# EAGLE design Lucette_V05 (EAGLE 6.1)
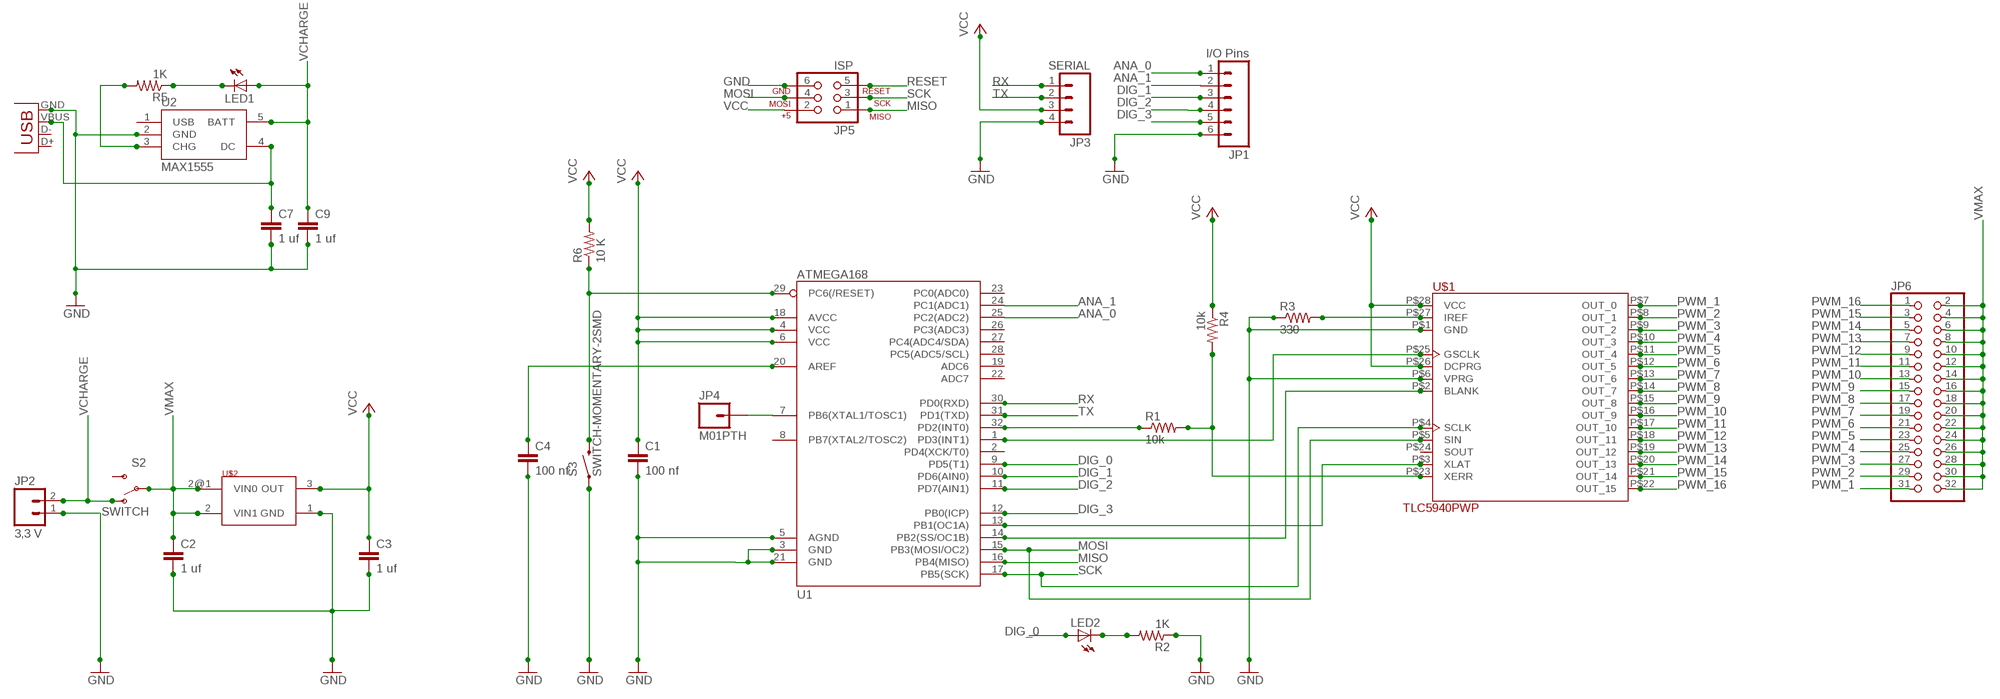
[diagram p0: schematic, sheet 1]

## Parts
C1  100 nf  CAP0805  [0805]
C2  1 uf  CAP0805  [0805]
C3  1 uf  CAP0805  [0805]
C4  100 nf  CAP0805  [0805]
C7  1 uf  CAP0805  [0805]
C9  1 uf  CAP0805  [0805]
JP1  I/O Pins  M06SMD  [1X06-SMD]
JP2  3,3 V  M02-JST-2MM-SMT  [S2B-PH]
JP3  SERIAL  M04SMD  [1X04-SMD]
JP4  M01PTH  [1X01]
JP5  ISP  AVR_SPI_PRG_6PTH  [2X3]
JP6  PINHD-2X16/90  [2X16/90]
LED1  LEDCHIP-LED0805  [CHIP-LED0805]
LED2  LEDCHIP-LED0805  [CHIP-LED0805]
R1  10k  RESISTOR1206  [1206]
R2  1K  RESISTOR1206  [1206]
R3  330  RESISTOR1206  [1206]
R4  10k  RESISTOR1206  [1206]
R5  1K  RESISTOR1206  [1206]
R6  10 K  RESISTOR1206  [1206]
S2  SWITCH  SWITCH-SPSTSMD  [AYZ0202]
S3  SWITCH-MOMENTARY-2SMD  [TACTILE_SWITCH_SMD]
U1  ATMEGA168  [TQFP32-08]
U2  MAX1555  [SOT23-5]
U$1  TLC5940PWP  [PWP-28]
U$2  MCP1703  [SOT98]
X1  USBOLD  [USB-MINIB-OLD]

## Nets
ANA_0: JP1.1 U1.25(PC2(ADC2))
ANA_1: JP1.2 U1.24(PC1(ADC1))
DIG_0: LED2.A U1.9(PD5(T1))
DIG_1: JP1.3 U1.10(PD6(AIN0))
DIG_2: JP1.4 U1.11(PD7(AIN1))
DIG_3: JP1.5 U1.12(PB0(ICP))
GND [gnd_plane]: C1.2 C2.2 C3.2 C4.2 C7.2 C9.2 JP1.6 JP2.1 JP3.4 JP5.6 R2.1 R3.1 S3.1 U1.3(GND) U1.5(AGND) U1.21(GND) U2.2(GND) U$1.P$1(GND) U$1.P$6(VPRG) U$2.1(GND) X1.GND
MISO: JP5.1 U1.16(PB4(MISO))
MOSI: JP5.4 U1.15(PB3(MOSI/OC2)) U$1.P$5(SIN)
N$1: R1.2 R4.2 U$1.P$23(XERR)
N$2: R1.1 U1.32(PD2(INT0))
N$3: C7.1 U2.4(DC) X1.VBUS
N$5: R5.2 U2.3(CHG)
N$6: U1.13(PB1(OC1A)) U$1.P$3(XLAT)
N$7: LED1.C R5.1
N$8: C4.1 U1.20(AREF)
N$9: R3.2 U$1.P$27(IREF)
N$10: JP4.1 U1.7(PB6(XTAL1/TOSC1))
N$11: LED2.C R2.2
N$31: U1.1(PD3(INT1)) U$1.P$25(GSCLK)
N$47: U1.14(PB2(SS/OC1B)) U$1.P$2(BLANK)
PWM_1: JP6.31 U$1.P$7(OUT_0)
PWM_2: JP6.29 U$1.P$8(OUT_1)
PWM_3: JP6.27 U$1.P$9(OUT_2)
PWM_4: JP6.25 U$1.P$10(OUT_3)
PWM_5: JP6.23 U$1.P$11(OUT_4)
PWM_6: JP6.21 U$1.P$12(OUT_5)
PWM_7: JP6.19 U$1.P$13(OUT_6)
PWM_8: JP6.17 U$1.P$14(OUT_7)
PWM_9: JP6.15 U$1.P$15(OUT_8)
PWM_10: JP6.13 U$1.P$16(OUT_9)
PWM_11: JP6.11 U$1.P$17(OUT_10)
PWM_12: JP6.9 U$1.P$18(OUT_11)
PWM_13: JP6.7 U$1.P$19(OUT_12)
PWM_14: JP6.5 U$1.P$20(OUT_13)
PWM_15: JP6.3 U$1.P$21(OUT_14)
PWM_16: JP6.1 U$1.P$22(OUT_15)
RESET: JP5.5 R6.1 S3.3 U1.29(PC6(/RESET))
RX: JP3.1 U1.30(PD0(RXD))
SCK: JP5.3 U1.17(PB5(SCK)) U$1.P$4(SCLK)
TX: JP3.2 U1.31(PD1(TXD))
VCC: C1.1 C3.1 JP3.3 JP5.2 R4.1 R6.2 U1.4(VCC) U1.6(VCC) U1.18(AVCC) U$1.P$26(DCPRG) U$1.P$28(VCC) U$2.3(OUT)
VCHARGE [VDD]: C9.1 JP2.2 LED1.A S2.1(O) U2.5(BATT)
VMAX [VDD]: C2.1 JP6.2 JP6.4 JP6.6 JP6.8 JP6.10 JP6.12 JP6.14 JP6.16 JP6.18 JP6.20 JP6.22 JP6.24 JP6.26 JP6.28 JP6.30 JP6.32 S2.2(P) U$2.2(VIN1) U$2.2@1(VIN0)
Unconnected: S2.3(S) U1.2(PD4(XCK/T0)) U1.8(PB7(XTAL2/TOSC2)) U1.19(ADC6) U1.22(ADC7) U1.23(PC0(ADC0)) U1.26(PC3(ADC3)) U1.27(PC4(ADC4/SDA)) U1.28(PC5(ADC5/SCL)) U2.1(USB) U$1.P$24(SOUT) X1.D+ X1.D-

## Library data of the parts
C1-C4 C7 C9 = spark-fun:CAP: Capacitor Standard 0603 ceramic capacitor, and 0.1" leaded capacitor.
JP1 = spark-fun:M06: Header 6 Standard 6-pin 0.1" header. Use with straight break away headers (SKU : PRT-00116), right angle break away headers (PRT-00553), swiss pins (PRT-00743), machine pins (PRT-00117), and female headers (PRT-00115). Molex polarized connector foot print use with SKU : PRT-08094 with associated crimp pins and housings. NOTES ON THE VARIANTS LOCK and LOCK_LONGPADS... This footprint was designed to help hold the alignment of a through-hole component (i.e. 6-pin header) while soldering it into place. You may notice that each hole has been shifted either up or down by 0.005 of an inch from it's more standard position (which is a perfectly straight line). This slight alteration caused the pins (the squares in the middle) to touch the edges of the holes. Because they are alternating, it causes a "brace" to hold the component in place. 0.005 has proven to be the perfect amount of "off-center" position when using our standard breakaway headers. Although looks a little odd when you look at the bare footprint, once you have a header in there, the alteration is very hard to notice. Also, if you push a header all the way into place, it is covered up entirely on the bottom side. This idea of altering the position of holes to aid alignment will be further integrated into the Sparkfun Library for other footprints. It can help hold any component with 3 or more connection pins.
JP2 = spark-fun:M02: Header 2 Standard 2-pin 0.1" header. Use with straight break away headers (SKU : PRT-00116), right angle break away headers (PRT-00553), swiss pins (PRT-00743), machine pins (PRT-00117), and female headers (PRT-00115). Molex polarized connector foot print use with SKU : PRT-08233 with associated crimp pins and housings.
JP3 = spark-fun:M04: Header 4 Standard 4-pin 0.1" header. Use with straight break away headers (SKU : PRT-00116), right angle break away headers (PRT-00553), swiss pins (PRT-00743), machine pins (PRT-00117), and female headers (PRT-00115). Molex polarized connector foot print use with SKU : PRT-08231 with associated crimp pins and housings.
JP4 = SparkFun:M01: Header 1 Standard 1-pin 0.1" header. Use with straight break away headers (SKU : PRT-00116), right angle break away headers (PRT-00553), swiss pins (PRT-00743), machine pins (PRT-00117), and female headers (PRT-00115).
JP5 = SparkFun:AVR_SPI_PRG_6: AVR ISP 6 Pin This is the reduced ISP connector for AVR programming. Common on Arduino. This footprint will take up less PCB space and can be used with a 10-pin to 6-pin adapter such as SKU: BOB-08508
JP6 = pinhead:PINHD-2X16: PIN HEADER
LED1 LED2 = led:LED: LED OSRAM: - CHIPLED LG R971, LG N971, LY N971, LG Q971, LY Q971, LO R971, LY R971 LH N974, LH R974 LS Q976, LO Q976, LY Q976 LO Q996 - Hyper CHIPLED LW Q18S LB Q993, LB Q99A, LB R99A - SideLED LS A670, LO A670, LY A670, LG A670, LP A670 LB A673, LV A673, LT A673, LW A673 LH A674 LY A675 LS A676, LA A676, LO A676, LY A676, LW A676 LS A679, LY A679, LG A679 - Hyper Micro SIDELED® LS Y876, LA Y876, LO Y876, LY Y876 LT Y87S - SmartLED LW L88C, LW L88S LB L89C, LB L89S, LG L890 LS L89K, LO L89K, LY L89K LS L896, LA L896, LO L896, LY L896 - TOPLED LS T670, LO T670, LY T670, LG T670, LP T670 LSG T670, LSP T670, LSY T670, LOP T670, LYG T670 LG T671, LOG T671, LSG T671 LB T673, LV T673, LT T673, LW T673 LH T674 LS T676, LA T676, LO T676, LY T676, LB T676, LH T676, LSB T676, LW T676 LB T67C, LV T67C, LT T67C, LS T67K, LO T67K, LY T67K, LW E67C LS E67B, LA E67B, LO E67B, LY E67B, LB E67C, LV E67C, LT E67C LW T67C LS T679, LY T679, LG T679 LS T770, LO T770, LY T770, LG T770, LP T770 LB T773, LV T773, LT T773, LW T773 LH T774 LS E675, LA E675, LY E675, LS T675 LS T776, LA T776, LO T776, LY T776, LB T776 LHGB T686 LT T68C, LB T68C - Hyper Mini TOPLED® LB M676 - Mini TOPLED Santana® LG M470 LS M47K, LO M47K, LY M47K Source: http://www.osram.convergy.de LUXEON: - LUMILED® LXK2-PW12-R00, LXK2-PW12-S00, LXK2-PW14-U00, LXK2-PW14-V00 LXK2-PM12-R00, LXK2-PM12-S00, LXK2-PM14-U00 LXK2-PE12-Q00, LXK2-PE12-R00, LXK2-PE12-S00, LXK2-PE14-T00, LXK2-PE14-U00 LXK2-PB12-K00, LXK2-PB12-L00, LXK2-PB12-M00, LXK2-PB14-N00, LXK2-PB14-P00, LXK2-PB14-Q00 LXK2-PR12-L00, LXK2-PR12-M00, LXK2-PR14-Q00, LXK2-PR14-R00 LXK2-PD12-Q00, LXK2-PD12-R00, LXK2-PD12-S00 LXK2-PH12-R00, LXK2-PH12-S00 LXK2-PL12-P00, LXK2-PL12-Q00, LXK2-PL12-R00 Source: www.luxeon.com KINGBRIGHT: KA-3528ASYC Source: www.kingbright.com
R1-R6 = spark-fun:RESISTOR: Resistor Basic schematic elements and footprints for 0603, 1206, and PTH 1/10th watt (small) resistors.
S2 = spark-fun:SWITCH-SPST: SPST Switch Simple slide switch. Spark Fun Electronics SKU : COM-00102
S3 = spark-fun:SWITCH-MOMENTARY-2
U1 = spark-fun:ATMEGA168
U2 = spark-fun:MAX1555: MAX1555 Lithium Charger IC SOT-23 Lithium Polymer charging IC. Schematic element and footprint proven. Spark Fun Electronics SKU : COM-00674
U$1 = tlc5940:TLC5940
U$2 = MCP1703:MCP1703
X1 = spark-fun:USB: USB Connectors USB-B-PTH is fully proven SKU : PRT-00139 USB-miniB is fully proven SKU : PRT-00587 USB-A-PCB is untested. USB-A-H is throughly reviewed, but untested. Spark Fun Electronics SKU : PRT-00437 USB-B-SMT is throughly reviewed, but untested. Needs silkscreen touching up. USB-A-S has not been used/tested USB-MB-H has not been used/tested

## Net classes
0 default: width 0.24 mm, drill 0.8 mm, clearance 0.432 mm
2 gnd_plane: width 2 mm, drill 0.8 mm, clearance 0.025 mm
3 vcc: width 1 mm, drill 0.8 mm, clearance 0.381 mm
4 VDD: width 1 mm, clearance 0.381 mm

## Board
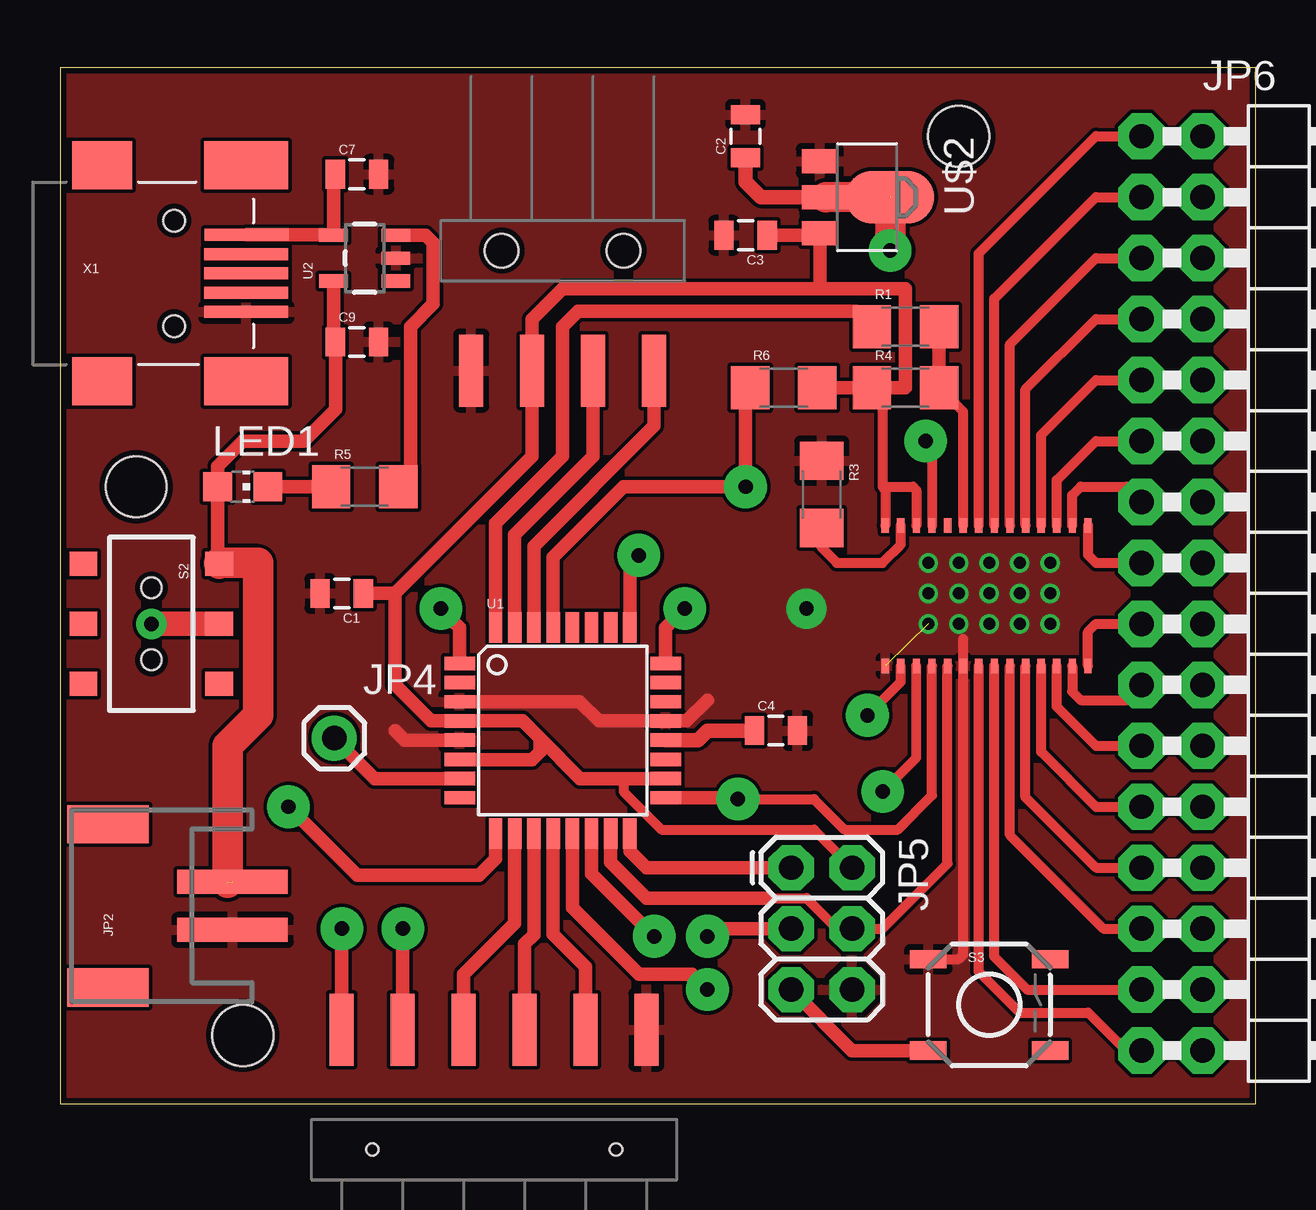
[diagram p1: board, top side]
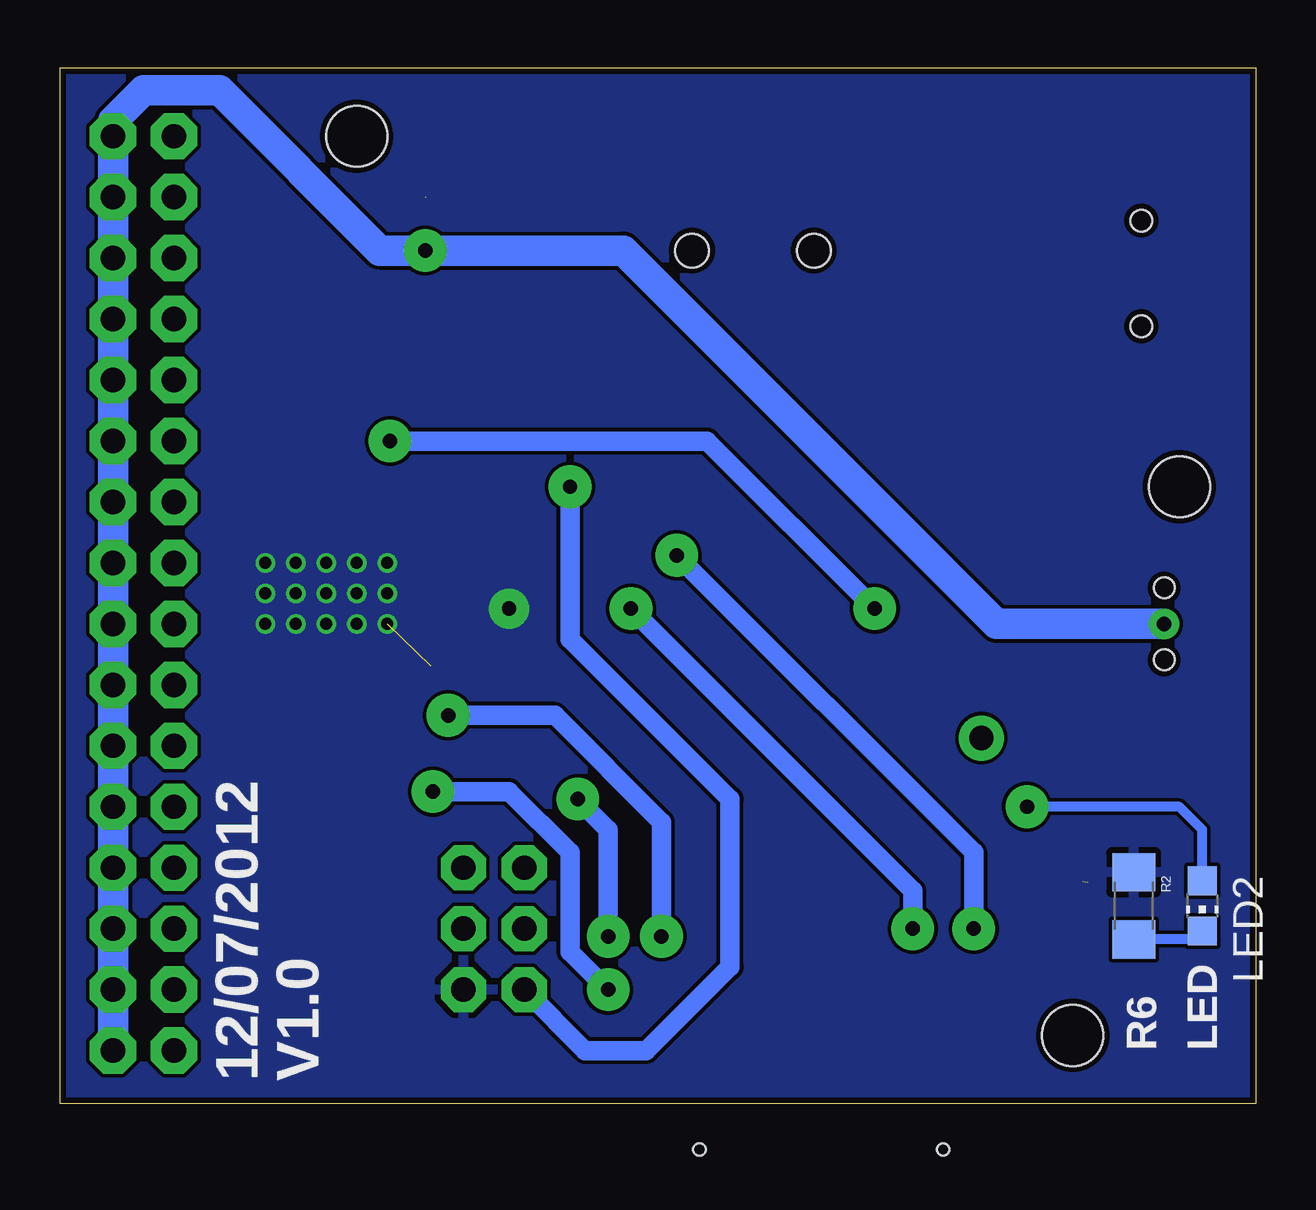
[diagram p2: board, bottom side, seen from below]

Size 49.84 x 43.17 mm. Coordinates in mm from the lower left corner, seen from the top.
Outline: 0,0 49.84,0 49.84,43.17 0,43.17 0,0
Copper layers (1*16): Top 0.035mm / dielectric 1.5mm / Bottom 0.035mm
Design rules "default": minimum track width 6mil, minimum drill 12mil, track to track 6mil, track to pad 6mil, pad to pad 6mil, via to via 6mil, smd to smd 0mil, copper to edge 10mil, drill to drill 10mil, minimum pad ring 10mil, minimum via ring 6mil, stop-mask expansion 2mil, vias tented up to drill 100mil, thermal gap 10mil
Holes 2.54 mm at 3.17,25.72 7.62,2.86 37.47,40.32

### Footprints (pad centres in the part's own frame; a part is rotated, then mirrored left to right if it is on the bottom)
0805 = smd 0.8 x 1.2: 1 -0.9,0; 2 0.9,0
1X06-SMD = smd 1 x 3: 1 -6.35,5; 2 -3.81,5; 3 -1.27,5; 4 1.27,5; 5 3.81,5; 6 6.35,5 | hole 0.508: -5.08,0; 5.08,0
S2B-PH = smd 1 x 4.6: 1 -1,-3.7; 2 1,-3.7 | smd 1.6 x 3.4: NC1 -3.4,1.5; NC2 3.4,1.5
1X04-SMD = smd 1 x 3: 1 -3.81,5; 2 -1.27,5; 3 1.27,5; 4 3.81,5 | hole 1.4: -2.54,0; 2.54,0
1X01 = drill 1.016 pad 1.88: 1 0,0
2X3 = drill 1.016 pad 1.88 octagon: 1 0,0; 2 0,2.54; 3 2.54,0; 4 2.54,2.54; 5 5.08,0; 6 5.08,2.54
2X16/90 = drill 1.016 pad 1.93 octagon: 1 -19.05,-6.35; 2 -19.05,-3.81; 3 -16.51,-6.35; 4 -16.51,-3.81; 5 -13.97,-6.35; 6 -13.97,-3.81; 7 -11.43,-6.35; 8 -11.43,-3.81; 9 -8.89,-6.35; 10 -8.89,-3.81; 11 -6.35,-6.35; 12 -6.35,-3.81; 13 -3.81,-6.35; 14 -3.81,-3.81; 15 -1.27,-6.35; 16 -1.27,-3.81; 17 1.27,-6.35; 18 1.27,-3.81; 19 3.81,-6.35; 20 3.81,-3.81; 21 6.35,-6.35; 22 6.35,-3.81; 23 8.89,-6.35; 24 8.89,-3.81; 25 11.43,-6.35; 26 11.43,-3.81; 27 13.97,-6.35; 28 13.97,-3.81; 29 16.51,-6.35; 30 16.51,-3.81; 31 19.05,-6.35; 32 19.05,-3.81
CHIP-LED0805 = smd 1.2 x 1.2: A 0,-1.05; C 0,1.05
1206 = smd 1.6 x 1.8: 1 -1.4,0; 2 1.4,0
AYZ0202 = smd 1 x 1.15: 1 -2.5,2.825; 2 0,2.825; 3 2.5,2.825; 4 -2.5,-2.825; 5 0,-2.825; 6 2.5,-2.825 | hole 0.85: 1.5,0; -1.5,0
TACTILE_SWITCH_SMD = smd 1.524 x 0.762: 1 -2.54,1.905; 2 2.54,1.905; 3 -2.54,-1.905; 4 2.54,-1.905
TQFP32-08 = smd 1.27 x 0.559: 1 -4.293,2.8; 2 -4.293,2; 3 -4.293,1.2; 4 -4.293,0.4; 5 -4.293,-0.4; 6 -4.293,-1.2; 7 -4.293,-2; 8 -4.293,-2.8; 17 4.293,-2.8; 18 4.293,-2; 19 4.293,-1.2; 20 4.293,-0.4; 21 4.293,0.4; 22 4.293,1.2; 23 4.293,2; 24 4.293,2.8 | smd 0.559 x 1.27: 9 -2.8,-4.293; 10 -2,-4.293; 11 -1.2,-4.293; 12 -0.4,-4.293; 13 0.4,-4.293; 14 1.2,-4.293; 15 2,-4.293; 16 2.8,-4.293; 25 2.8,4.293; 26 2,4.293; 27 1.2,4.293; 28 0.4,4.293; 29 -0.4,4.293; 30 -1.2,4.293; 31 -2,4.293; 32 -2.8,4.293
SOT23-5 = smd 0.55 x 1.2: 1 -0.95,-1.3; 2 0,-1.3; 3 0.95,-1.3; 4 0.95,1.3; 5 -0.95,1.3
PWP-28 = smd 0.61 x 0.305: P$1 -7.15,9.1; P$2 -7.15,8.45; P$3 -7.15,7.8; P$4 -7.15,7.15; P$5 -7.15,6.5; P$6 -7.15,5.85; P$7 -7.15,5.2; P$8 -7.15,4.55; P$9 -7.15,3.9; P$10 -7.15,3.25; P$11 -7.15,2.6; P$12 -7.15,1.95; P$13 -7.15,1.3; P$14 -7.15,0.65; P$15 -1.3,0.65; P$16 -1.3,1.3; P$17 -1.3,1.95; P$18 -1.3,2.6; P$19 -1.3,3.25; P$20 -1.3,3.9; P$21 -1.3,4.55; P$22 -1.3,5.2; P$23 -1.3,5.85; P$24 -1.3,6.5; P$25 -1.3,7.15; P$26 -1.3,7.8; P$27 -1.3,8.45; P$28 -1.3,9.1
SOT98 = smd 1 x 1.5: 1 -1.499,-1.981; 3 1.499,-1.981 | smd 1 x 2: 2 0,-1.727 | smd 2.2 x 3.7: 2@1 0,0.94
USB-MINIB-OLD = smd 2.5 x 2: 1 -3,-4.5; 2 -3,4.5 | smd 3.5 x 2: 3 3,-4.5; 4 3,4.5 | smd 3.5 x 0.5: D+ 3,0; D- 3,0.8; GND 3,-1.6; ID 3,-0.8; VBUS 3.01,1.61 | hole 0.9: 0,2.2; 0,-2.2

### Placement (x,y rotation side)
C1  11.75,21.27 180 top
C2  28.57,40.32 90 top
C3  28.57,36.2 180 top
C4  29.84,15.56 0 top
C7  12.38,38.73 0 top
C9  12.38,31.75 0 top
JP1  18.1,-1.9 0 top
JP2  3.49,8.25 90 top
JP3  20.95,35.56 180 top
JP4  11.43,15.24 0 top
JP5  30.48,9.84 270 top
JP6  51.44,21.27 270 top
LED1  7.62,25.72 270 top
LED2  2.22,8.25 180 bottom
R1  35.24,32.38 0 top
R2  5.08,8.25 270 bottom
R3  31.75,25.4 270 top
R4  35.24,29.85 0 top
R5  12.7,25.72 0 top
R6  30.16,29.85 0 top
S2  3.81,20 270 top
S3  38.73,4.13 0 top
U1  20.95,15.56 0 top
U2  12.7,35.24 90 top
U$1  43.5,25.4 90 top
U$2  33.66,37.78 270 top
X1  4.76,34.61 0 top

### Tracks (layer width: path | path; a pad name or v marks a point on that pad's centre or on a via)
ANA_0  (via drill 0.6 pad 1.78)
  Top 0.559: JP1.1 v11.75,7.3 | U1.25 23.75,22.48 v24.13,22.86
  Bottom 0.813: v24.13,22.86 11.75,10.48 v11.75,7.3
ANA_1  (via drill 0.6 pad 1.78)
  Top 0.559: U1.24 25.25,19.85 v26.04,20.64 | JP1.2 14.37,3.1 14.29,3.18 v14.29,7.3
  Bottom 0.813: v26.04,20.64 14.29,8.89 14.29,7.62 14.61,7.3 v14.29,7.3
DIG_0  (via drill 0.6 pad 1.78)
  Top 0.559: U1.9 18.15,10.22 17.46,9.52 12.38,9.52 v9.53,12.38
  Bottom 0.406: LED2.A 2.22,11.43 3.17,12.38 v9.53,12.38
DIG_1
  Top 0.559: U1.10 18.95,7.53 16.83,5.4 JP1.3
DIG_2
  Top 0.559: JP1.4 19.37,6.67 19.75,7.05 U1.11
DIG_3
  Top 0.559: JP1.5 21.91,5.71 20.55,7.07 U1.12
GND  (via drill 0.5 pad 0.25, 0.6 pad 1.68)  (1 unrouted)
  Top 0.406: S3.1 37.47,6.03 37.65,6.21 U$1.P$6 37.65,19.37
  Top 0.559: 26.99,16.83 26.12,15.96 U1.21 22.46,15.96 21.66,16.76 U1.3 | U1.5 14.37,15.16 13.97,15.56
  other vias: 31.11,20.64 36.2,22.54 37.47,22.54 38.73,22.54 40.01,22.54 41.27,22.54 41.27,21.27 40.01,21.27 38.73,21.27 37.47,21.27 36.2,21.27 36.2,20 37.47,20 38.73,20 40.01,20 41.27,20
  pour Top: 49.85,0 0,0 0,43.18 49.85,43.18
  pour Bottom: 0,43.18 49.85,43.18 49.85,0 0,0
MISO
  Top 0.559: JP5.1 24.45,9.84 23.75,10.53 U1.16
MOSI
  Top 0.406: U$1.P$5 37,10.01 34.29,7.3 JP5.4 32.39,7.3 31.11,8.57 29.53,8.57
  Top 0.559: U1.15 22.95,10.07 24.45,8.57 29.53,8.57
N$1
  Top 0.406: U$1.P$23 37.65,28.84 R4.2
  Top 0.559: R4.2 R1.2
N$2
  Top 0.559: U1.32 18.15,24.19 20.95,26.99 20.95,32.39 21.59,33.02 33.21,33.02 R1.1
N$3
  Top 0.559: C7.1 11.4,38.12 U2.4 11.38,36.22 X1.VBUS
N$5
  Top 0.559: U2.3 15.24,36.19 15.56,35.88 15.56,33.34 14.61,32.39 14.61,26.22 R5.2
N$6  (via drill 0.6 pad 1.78)
  Top 0.406: U$1.P$3 35.7,14.42 v34.29,13.02
  Top 0.559: U1.13 21.35,8.17 24.13,5.4 26.35,5.4 v26.99,4.76
  Bottom 0.813: v34.29,13.02 31.11,13.02 28.57,10.48 28.57,6.35 v26.99,4.76
N$7
  Top 0.559: LED1.C R5.1
N$8
  Top 0.61: U1.20 26.59,15.16 26.99,15.56 C4.1
N$9
  Top 0.406: U$1.P$27 35.05,23.3 34.29,22.54 32.39,22.54 31.75,23.18 R3.2
N$10
  Top 0.559: JP4.1 13.11,13.56 U1.7
N$11
  Bottom 0.406: LED2.C 2.57,6.86 R2.2
N$31  (via drill 0.6 pad 1.78)
  Top 0.254: U1.1 16.64,18.35
  Top 0.305: 36.35,24.76
  Top 0.406: 36.35,24.76 36.35,27.47 v36.08,27.62 | 36.35,24.76 U$1.P$25
  Top 0.559: U1.1 16.66,19.85 v15.88,20.64
  Bottom 0.813: v36.08,27.62 22.86,27.62 v15.88,20.64
N$47  (via drill 0.6 pad 1.78)
  Top 0.254: 35.05,18.22 U$1.P$2
  Top 0.406: 35.05,18.22 35.05,17.59 v33.66,16.19
  Top 0.559: U1.14 22.15,9.59 v24.76,6.99
  Bottom 0.813: v24.76,6.99 24.76,11.75 29.21,16.19 v33.66,16.19
PWM_1
  Top 0.406: U$1.P$7 38.3,5.52 40.01,3.81 42.86,3.81 44.45,2.22 JP6.31
PWM_2
  Top 0.406: U$1.P$8 38.95,6.14 40.32,4.76 JP6.29
PWM_3
  Top 0.406: U$1.P$9 39.6,11.2 43.5,7.3 JP6.27
PWM_4
  Top 0.406: U$1.P$10 40.25,12.77 43.18,9.84 JP6.25
PWM_5
  Top 0.406: U$1.P$11 40.9,14.66 43.18,12.38 JP6.23
PWM_6
  Top 0.406: U$1.P$12 41.55,16.55 43.18,14.92 JP6.21
PWM_7
  Top 0.406: U$1.P$13 42.2,17.17 42.55,16.83 44.45,16.83 JP6.19
PWM_8
  Top 0.406: U$1.P$14 42.85,19.67 43.18,20 JP6.17
PWM_9
  Top 0.406: U$1.P$15 42.85,22.87 43.18,22.54 JP6.15
PWM_10
  Top 0.406: U$1.P$16 42.2,25.37 42.55,25.72 44.45,25.72 JP6.13
PWM_11
  Top 0.406: U$1.P$17 41.55,25.99 43.18,27.62 JP6.11
PWM_12
  Top 0.406: U$1.P$18 40.9,27.88 43.18,30.16 JP6.9
PWM_13
  Top 0.406: U$1.P$19 40.25,29.77 43.18,32.7 JP6.7
PWM_14
  Top 0.406: U$1.P$20 39.6,31.66 43.18,35.24 JP6.5
PWM_15
  Top 0.406: U$1.P$21 38.95,33.55 43.18,37.78 JP6.3
PWM_16
  Top 0.406: U$1.P$22 38.3,35.44 43.18,40.32 JP6.1
RESET  (via drill 0.6 pad 1.78)
  Top 0.559: U1.29 20.55,22.78 23.49,25.72 v28.57,25.72 28.57,30.03 R6.1 | JP5.5 33.02,2.22 S3.3
  Bottom 0.813: JP5.5 27.94,2.22 25.4,2.22 21.91,5.71 21.91,12.7 28.57,19.37 v28.57,25.72
RX
  Top 0.559: U1.30 19.75,23.25 24.76,28.26 JP3.1
SCK  (via drill 0.6 pad 1.78)
  Top 0.406: v28.26,12.7 31.43,12.7 32.7,11.43 34.93,11.43 36.35,12.85 U$1.P$4
  Top 0.559: v26.99,6.99 27.3,7.3 JP5.3 | U1.17 28.2,12.76 v28.26,12.7
  Bottom 0.813: v26.99,6.99 26.99,11.43 v28.26,12.7
TX
  Top 0.559: U1.31 18.95,23.72 22.22,26.99 JP3.2
VCC
  Top 0.305: U$1.P$26
  Top 0.406: 23.49,13.56 23.49,13.02 25.08,11.43 31.43,11.43 JP5.2 | U$1.P$26 35.7,25.58 35.56,25.72 34.29,25.72 | U$1.P$28 34.4,25.61 34.29,25.72 | 34.29,25.72 34.29,29.71 R4.1
  Top 0.559: U1.18 23.49,13.56 21.68,13.56 20,15.24 | R6.2 R4.1 35.24,29.85 35.24,33.97 31.75,33.97 | 31.75,33.97 20.95,33.97 19.68,32.7 JP3.3 19.68,26.99 13.97,21.27 | 13.97,21.27 13.97,17.46 15.47,15.96 U1.4 19.29,15.96 20,15.24 | C1.1 13.97,21.27 | C3.1 31.59,36.2 U$2.3 31.67,34.05 31.75,33.97 | U1.6 16.67,14.35 19.68,14.35 20,14.67 20,15.24
VCHARGE  (1 unrouted)
  Top 0.559: U2.5 11.4,31.83 C9.1 11.48,28.94 10.16,27.62 7.62,27.62 6.57,26.57 LED1.A 6.57,22.57 S2.1 | 6.63,22.54 6.35,22.54
  Top 1.27: 6.99,9.21 6.99,14.92 8.26,16.19 8.26,22.54 6.63,22.54 S2.1
VMAX  (via drill 0.6 pad 1.27, 0.6 pad 1.78)  (1 unrouted)
  Top 0.61: C2.1 28.57,38.42 29.21,37.78 U$2.2 32.39,37.78
  Top 1.016: S2.2 v3.81,20
  Top 1.27: U$2.2 34.61,37.79 v34.61,35.56
  Bottom 1.27: JP6.32 JP6.30 JP6.28 JP6.26 JP6.24 JP6.22 JP6.20 JP6.18 JP6.16 JP6.14 JP6.12 JP6.10 JP6.8 JP6.6 JP6.4 JP6.2 47.62,40.96 46.36,42.23 43.18,42.23 36.51,35.56 v34.61,35.56 26.35,35.56 10.79,20 v3.81,20

### Text on the board
_tsilk: 16 PWM/120mA | LDO | C3 | C1 | C4 | R3 | R2 | R4 | C2 | LED | GND | VCC | TX | RX | R1 | C6 | R5 | C5 | PB6 | OFF | PD5 | A2 | A1 | D6 | D7 | D8 | GND
_bsilk: LED | R6 | V1.0 | 12/07/2012